# EAGLE design ESP8266_D1_Mini_Breakout (EAGLE 9.6.2)
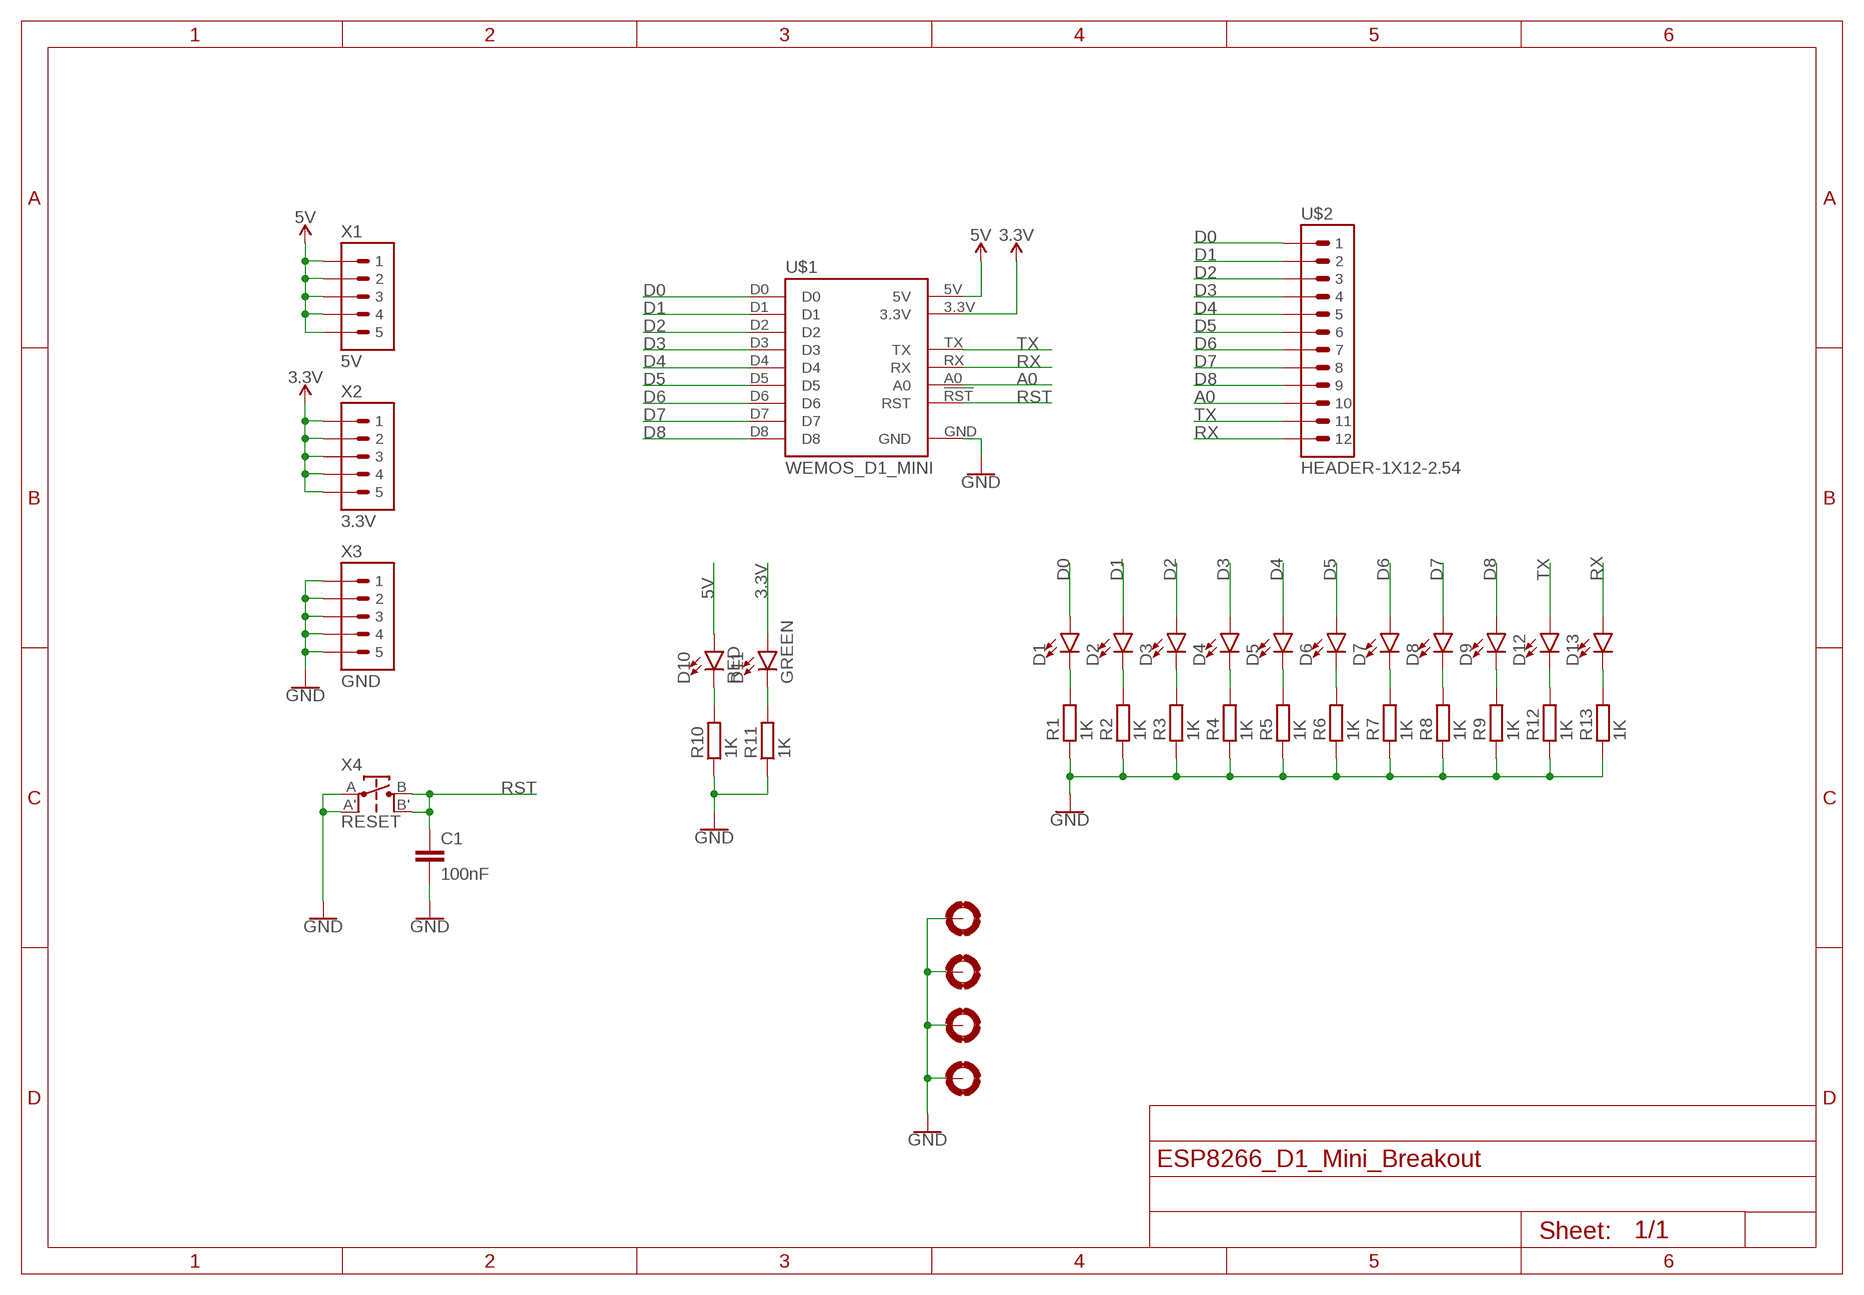
[diagram p0: schematic, sheet 1]

## Parts
C1  100nF  CAPC0603  [C0603]
D1  LED0603  [LED0603]
D2  LED0603  [LED0603]
D3  LED0603  [LED0603]
D4  LED0603  [LED0603]
D5  LED0603  [LED0603]
D6  LED0603  [LED0603]
D7  LED0603  [LED0603]
D8  LED0603  [LED0603]
D9  LED0603  [LED0603]
D10  RED  LED0603  [LED0603]
D11  GREEN  LED0603  [LED0603]
D12  LED0603  [LED0603]
D13  LED0603  [LED0603]
H1  MOUNTHOLE-PAD3.2  [3.2-PAD]
H2  MOUNTHOLE-PAD3.2  [3.2-PAD]
H3  MOUNTHOLE-PAD3.2  [3.2-PAD]
H4  MOUNTHOLE-PAD3.2  [3.2-PAD]
R1  1K  RESISTOR0603  [R0603]
R2  1K  RESISTOR0603  [R0603]
R3  1K  RESISTOR0603  [R0603]
R4  1K  RESISTOR0603  [R0603]
R5  1K  RESISTOR0603  [R0603]
R6  1K  RESISTOR0603  [R0603]
R7  1K  RESISTOR0603  [R0603]
R8  1K  RESISTOR0603  [R0603]
R9  1K  RESISTOR0603  [R0603]
R10  1K  RESISTOR0603  [R0603]
R11  1K  RESISTOR0603  [R0603]
R12  1K  RESISTOR0603  [R0603]
R13  1K  RESISTOR0603  [R0603]
U$1  WEMOS_D1_MINI  [WEMOS_D1_MINI]
U$2  HEADER-1X12-2.54  [1X12-2.54]
X1  5V  HEADER-1X05-2.54  [1X05-2.54]
X2  3.3V  HEADER-1X05-2.54  [1X05-2.54]
X3  GND  HEADER-1X05-2.54  [1X05-2.54]
X4  RESET  TACT-SWITCHEVQ  [TACT-SWITCH-EVQ]

## Nets
3.3V: D11.A U$1.3.3V X2.1 X2.2 X2.3 X2.4 X2.5
5V: D10.A U$1.5V X1.1 X1.2 X1.3 X1.4 X1.5
A0: U$1.A0 U$2.10
D0: D1.A U$1.D0 U$2.1
D1: D2.A U$1.D1 U$2.2
D2: D3.A U$1.D2 U$2.3
D3: D4.A U$1.D3 U$2.4
D4: D5.A U$1.D4 U$2.5
D5: D6.A U$1.D5 U$2.6
D6: D7.A U$1.D6 U$2.7
D7: D8.A U$1.D7 U$2.8
D8: D9.A U$1.D8 U$2.9
GND: C1.2 H1.B3,2(MOUNT) H2.B3,2(MOUNT) H3.B3,2(MOUNT) H4.B3,2(MOUNT) R1.1 R2.1 R3.1 R4.1 R5.1 R6.1 R7.1 R8.1 R9.1 R10.1 R11.1 R12.1 R13.1 U$1.GND X3.1 X3.2 X3.3 X3.4 X3.5 X4.A X4.A'
N$1: D11.C R11.2
N$2: D10.C R10.2
N$3: D13.C R13.2
N$4: D12.C R12.2
N$10: D9.C R9.2
N$11: D8.C R8.2
N$12: D7.C R7.2
N$13: D6.C R6.2
N$14: D5.C R5.2
N$15: D4.C R4.2
N$16: D3.C R3.2
N$17: D2.C R2.2
N$18: D1.C R1.2
RST: C1.1 U$1.!RST(RST) X4.B X4.B'
RX: D13.A U$1.RX U$2.12
TX: D12.A U$1.TX U$2.11

## Library data of the parts
C1 = M2M-Passives:CAP
D1-D13 = M2M-LED:LED: LED (Generic) Standard schematic elements and footprints for 5mm, 3mm, 1206, and 0603 sized LEDs. Generic LEDs with no color specified.
H1-H4 = M2M-Holes:MOUNTHOLE-PAD
R1-R13 = M2M-Passives:RESISTOR
U$1 = M2M-Modules:WEMOS_D1_MINI
U$2 = M2M-Connectors:HEADER-1X12-2.54
X1-X3 = M2M-Connectors:HEADER-1X05-2.54
X4 = M2M-Switches:TACT-SWITCH

## Board
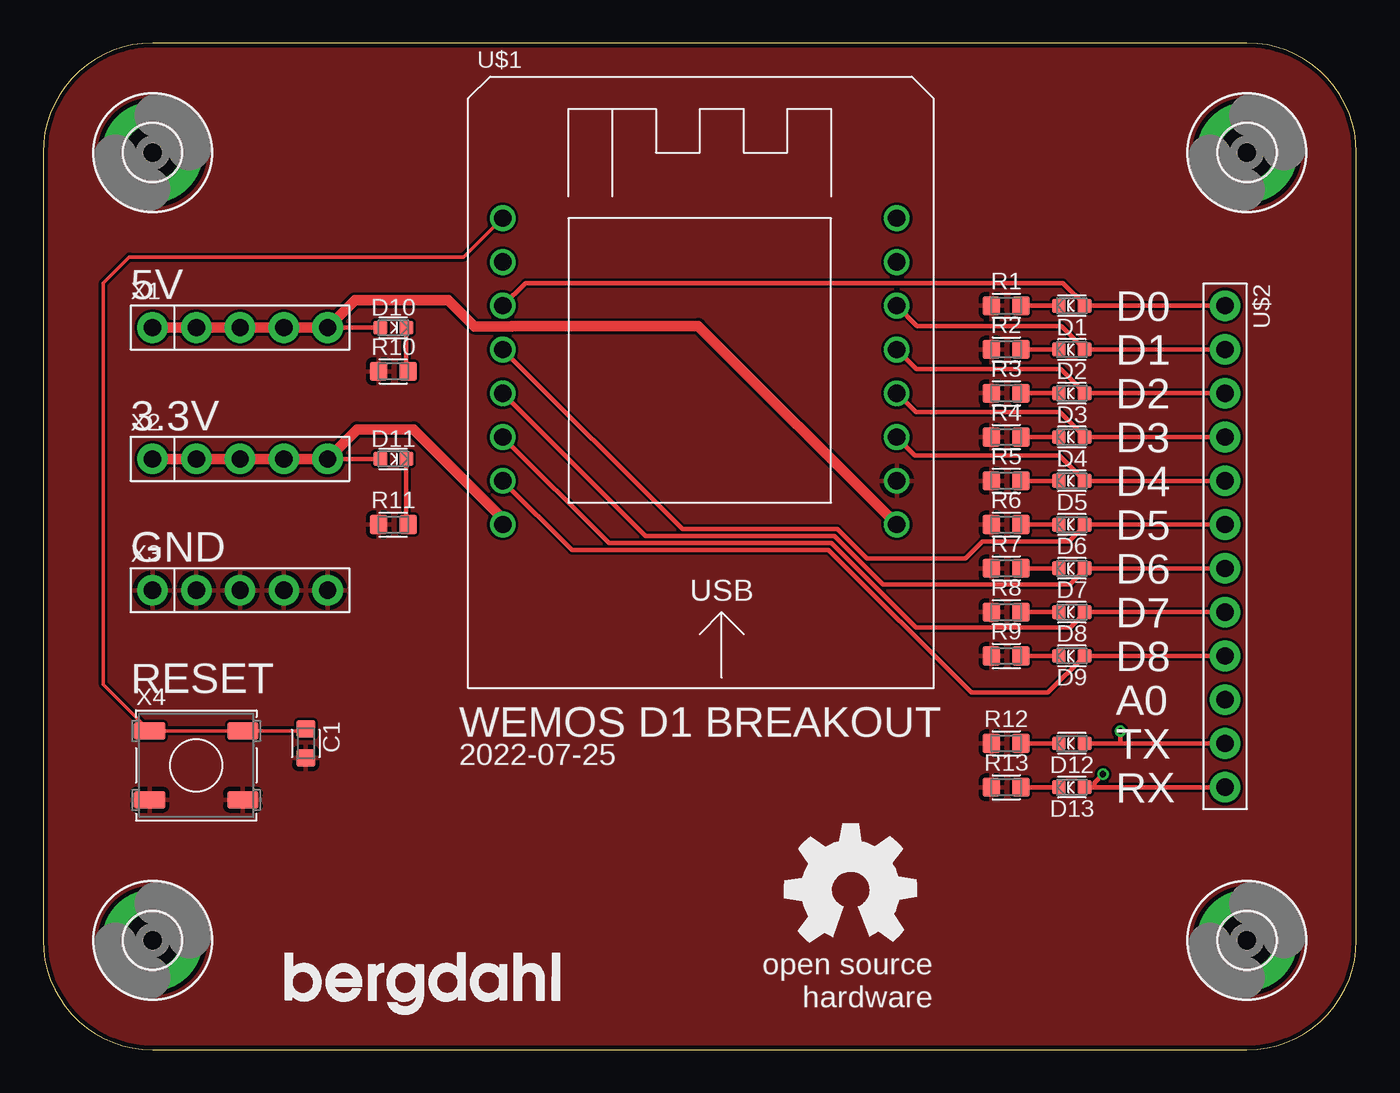
[diagram p1: board, top side]
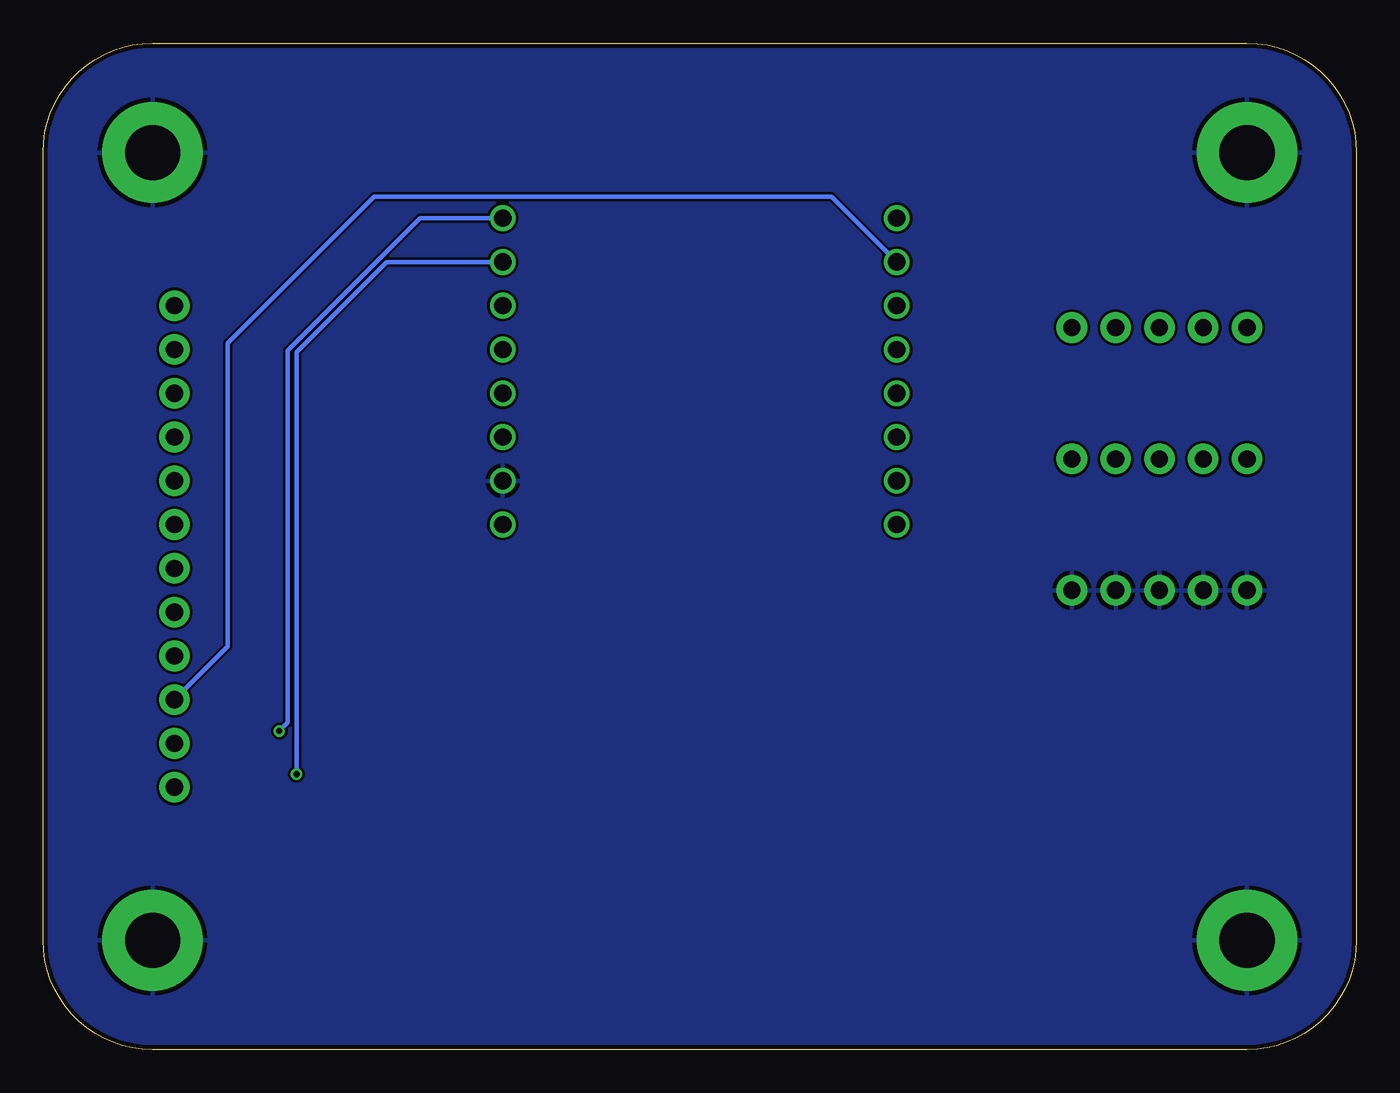
[diagram p2: board, bottom side, seen from below]

Size 76.2 x 58.42 mm. Coordinates in mm from the lower left corner, seen from the top.
Outline: 6.35,0 69.85,0 arc90 76.2,6.35 76.2,52.07 arc90 69.85,58.42 6.35,58.42 arc90 0,52.07 0,6.35 arc90 6.35,0
Copper layers (1*16): Top 0.035mm / dielectric 1.5mm / Bottom 0.035mm
Design rules "SeeedStudio_2layer_DRU_no_angle_20140221": minimum track width 6mil, minimum drill 0.3mm, track to track 6mil, track to pad 6mil, pad to pad 6mil, via to via 6mil, smd to smd 0mil, copper to edge 10mil, drill to drill 10mil, minimum pad ring 2mil, minimum via ring 6mil, stop-mask expansion 2mil, vias tented up to drill 1000mil, thermal gap 10mil

### Footprints (pad centres in the part's own frame; a part is rotated, then mirrored left to right if it is on the bottom)
C0603 = smd 1 x 1.1: 1 -0.85,0; 2 0.85,0
LED0603 = smd 0.8 x 0.8: A -0.75,0; C 0.75,0
3.2-PAD = drill 3.2 pad 5.842: B3,2 0,0
R0603 = smd 1 x 1.1: 1 -0.85,0; 2 0.85,0
WEMOS_D1_MINI = drill 1: 3.3V 0,0; 5V 22.86,0; !RST 0,17.78; A0 0,15.24; D0 0,12.7; D1 22.86,12.7; D2 22.86,10.16; D3 22.86,7.62; D4 22.86,5.08; D5 0,10.16; D6 0,7.62; D7 0,5.08; D8 0,2.54; GND 22.86,2.54; RX 22.86,15.24; TX 22.86,17.78
1X12-2.54 = drill 1 pad 1.778: 1 0,0; 2 2.54,0; 3 5.08,0; 4 7.62,0; 5 10.16,0; 6 12.7,0; 7 15.24,0; 8 17.78,0; 9 20.32,0; 10 22.86,0; 11 25.4,0; 12 27.94,0
1X05-2.54 = drill 1 pad 1.778: 1 0,0; 2 2.54,0; 3 5.08,0; 4 7.62,0; 5 10.16,0
TACT-SWITCH-EVQ = smd 1.8 x 1: A -2.7,-2; A' 2.7,-2; B -2.7,2; B' 2.7,2

### Placement (x,y rotation side)
C1  15.24,17.78 270 top
D1  59.69,43.18 180 top
D2  59.69,40.64 180 top
D3  59.69,38.1 180 top
D4  59.69,35.56 180 top
D5  59.69,33.02 180 top
D6  59.69,30.48 180 top
D7  59.69,27.94 180 top
D8  59.69,25.4 180 top
D9  59.69,22.86 180 top
D10  20.32,41.91 0 top
D11  20.32,34.29 0 top
D12  59.69,17.78 180 top
D13  59.69,15.24 180 top
H1  6.35,6.35 0 top
H2  69.85,6.35 0 top
H3  6.35,52.07 0 top
H4  69.85,52.07 0 top
R1  55.88,43.18 0 top
R2  55.88,40.64 0 top
R3  55.88,38.1 0 top
R4  55.88,35.56 0 top
R5  55.88,33.02 0 top
R6  55.88,30.48 0 top
R7  55.88,27.94 0 top
R8  55.88,25.4 0 top
R9  55.88,22.86 0 top
R10  20.32,39.37 0 top
R11  20.32,30.48 0 top
R12  55.88,17.78 0 top
R13  55.88,15.24 0 top
U$1  26.67,30.48 0 top
U$2  68.58,43.18 270 top
U$3  [BERGDAHL-20MM-TPLACE]  13.99,2.04 0 top
U$4  [OSHW-8MM-TPLACE]  46.83,9.29 0 top
X1  6.35,41.91 0 top
X2  6.35,34.29 0 top
X3  6.35,26.67 0 top
X4  8.89,16.51 0 top

### Tracks (layer width: path | path; a pad name or v marks a point on that pad's centre or on a via)
3.3V
  Top 0.254: X2.5 D11.A
  Top 0.61: X2.1 X2.2 X2.3 X2.4 X2.5 18.22,36 21.5,36 26.67,30.83 U$1.3.3V
5V
  Top 0.254: X1.5 D10.A
  Top 0.61: U$1.5V 38.01,42 27.2,42 27.17,41.97 25.03,41.97 23.5,43.5 18.1,43.5 X1.5 X1.4 X1.3 X1.2 X1.1
A0
  Bottom 0.254: U$1.A0 30.45,49.5 57,49.5 65.5,41 65.5,23.4 U$2.10
D0
  Top 0.254: D1.A 60.5,43.18 | 60.5,43.18 U$2.1 | U$1.D0 27.99,44.5 59.18,44.5 60.5,43.18
D1
  Top 0.254: U$2.2 D2.A 59.08,42 50.71,42 U$1.D1
D2
  Top 0.254: U$2.3 D3.A 59.04,39.5 50.67,39.5 U$1.D2
D3
  Top 0.254: U$2.4 D4.A 59,37 50.63,37 U$1.D3
D4
  Top 0.254: U$2.5 D5.A 58.96,34.5 50.59,34.5 U$1.D4
D5
  Top 0.254: D6.A 60.5,30.48 | 60.5,30.48 U$2.6 | U$1.D5 37.09,30.22 46.08,30.22 47.8,28.5 53.5,28.5 54.5,29.5 59.52,29.5 60.5,30.48
D6
  Top 0.254: D7.A 60.5,27.94 | 60.5,27.94 U$2.7 | U$1.D6 34.96,29.81 45.91,29.81 48.72,27 59.56,27 60.5,27.94
D7
  Top 0.254: D8.A 60.5,25.4 | 60.5,25.4 U$2.8 | U$1.D7 32.82,29.41 45.74,29.41 50.65,24.5 59.6,24.5 60.5,25.4
D8
  Top 0.254: U$2.9 D9.A 58.31,20.73 53.85,20.73 45.58,29 30.69,29 U$1.D8
GND
  pour Bottom: 0,58.42 76.2,58.42 76.2,0 0,0
  pour Top: 0,58.42 76.2,58.42 76.2,0 0,0
N$1
  Top 0.254: D11.C 21.07,30.58 R11.2
N$2
  Top 0.254: D10.C 21.07,39.47 R10.2
N$3
  Top 0.254: R13.2 D13.C
N$4
  Top 0.254: R12.2 D12.C
N$10
  Top 0.254: R9.2 D9.C
N$11
  Top 0.254: R8.2 D8.C
N$12
  Top 0.254: R7.2 D7.C
N$13
  Top 0.254: R6.2 D6.C
N$14
  Top 0.254: R5.2 D5.C
N$15
  Top 0.254: R4.2 D4.C
N$16
  Top 0.254: R3.2 D3.C
N$17
  Top 0.254: R2.2 D2.C
N$18
  Top 0.254: R1.2 D1.C
RST
  Top 0.203: C1.1 15.12,18.51 X4.B' X4.B 3.5,21.2 3.5,44.5 5,46 24.41,46 U$1.!RST
RX  (via drill 0.35)
  Top 0.254: D13.A 61,15.24 | 61,15.24 U$2.12 | v61.5,16 61,15.5 61,15.24
  Bottom 0.254: U$1.RX 56.28,45.72 61.5,40.5 v61.5,16
TX  (via drill 0.35)
  Top 0.254: D12.A 62.5,17.78 | 62.5,17.78 U$2.11 | v62.5,18.5 62.5,17.78
  Bottom 0.254: U$1.TX 54.31,48.26 62,40.58 62,19 v62.5,18.5

### Text on the board
tPlace: 5V | D0 | D1 | D2 | 3.3V | D3 | D4 | D5 | GND | D6 | D7 | D8 | RESET | A0 | WEMOS D1 BREAKOUT | TX | 2022-07-25 | RX